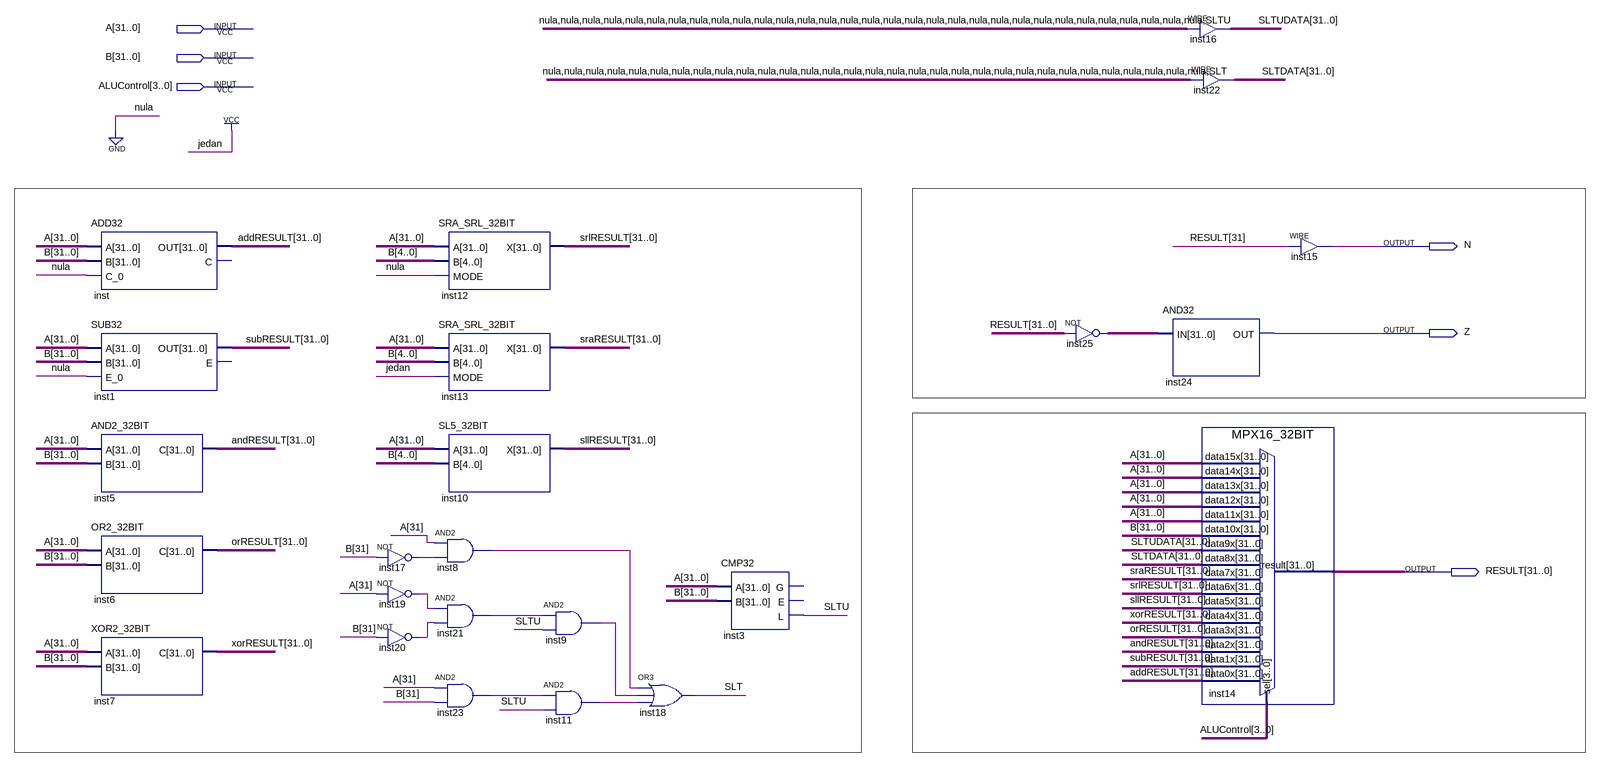
[diagram p0: schematic sheet]
// Quartus schematic ALU.bdf as structural Verilog: 24 symbols, 6 pins
module ALU (
  input  [31:0] A,
  input  [31:0] B,
  input  [3:0] ALUControl,
  output N,
  output Z,
  output [31:0] RESULT
);

  wire inst8_out, inst9_out, inst11_out, inst17_out, inst19_out, inst20_out, inst21_out, inst23_out, SLT,
       SLTU;
  wire [31:0] addRESULT, andRESULT, inst25_out, orRESULT, sllRESULT, SLTDATA, SLTUDATA, sraRESULT, srlRESULT,
       subRESULT, xorRESULT;

  ADD32 inst (.A(A), .B(B), .C_0(1'b0), .OUT(addRESULT));  // open: C
  SUB32 inst1 (.A(A), .B(B), .E_0(1'b0), .OUT(subRESULT));  // open: E
  AND2_32BIT inst5 (.A(A), .B(B), .C(andRESULT));
  OR2_32BIT inst6 (.A(A), .B(B), .C(orRESULT));
  XOR2_32BIT inst7 (.A(A), .B(B), .C(xorRESULT));
  not inst17 (inst17_out, B[31]);
  not inst19 (inst19_out, A[31]);
  not inst20 (inst20_out, B[31]);
  SRA_SRL_32BIT inst12 (.A(A), .B(B[4:0]), .MODE(1'b0), .X(srlRESULT));
  SRA_SRL_32BIT inst13 (.A(A), .B(B[4:0]), .MODE(1'b1), .X(sraRESULT));
  SL5_32BIT inst10 (.A(A), .B(B[4:0]), .X(sllRESULT));
  and inst8 (inst8_out, A[31], inst17_out);
  and inst21 (inst21_out, inst19_out, inst20_out);
  and inst23 (inst23_out, A[31], B[31]);
  and inst9 (inst9_out, inst21_out, SLTU);
  and inst11 (inst11_out, inst23_out, SLTU);
  or inst18 (SLT, inst8_out, inst9_out, inst11_out);
  CMP32 inst3 (.A(A), .B(B), .L(SLTU));  // open: G, E
  assign inst25_out = ~RESULT;  // NOT inst25, 32 bits wide
  assign SLTUDATA = {{31{1'b0}}, SLTU};  // WIRE inst16
  assign SLTDATA = {{31{1'b0}}, SLT};  // WIRE inst22
  AND32 inst24 (.IN(inst25_out), .OUT(Z));
  MPX16_32BIT inst14 (
    .data15x(A), .data14x(A), .data13x(A), .data12x(A), .data11x(A), .data10x(B), .data9x(SLTUDATA),
    .data8x(SLTDATA), .data7x(sraRESULT), .data6x(srlRESULT), .data5x(sllRESULT), .data4x(xorRESULT),
    .data3x(orRESULT), .data2x(andRESULT), .data1x(subRESULT), .data0x(addRESULT), .sel(ALUControl),
    .result(RESULT));
  assign N = RESULT[31];  // WIRE inst15
endmodule
